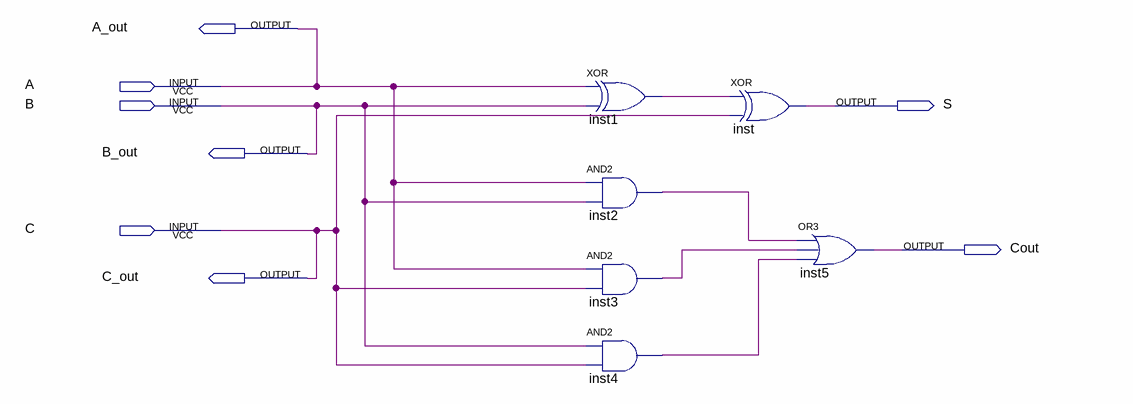
[diagram p0: schematic sheet]
// Quartus schematic Lab3Sec2_FullAdder.bdf as structural Verilog: 6 symbols, 8 pins
module Lab3Sec2_FullAdder (
  input  A,
  input  B,
  input  C,
  output A_out,
  output S,
  output B_out,
  output Cout,
  output C_out
);

  wire inst1_out, inst2_out, inst3_out, inst4_out;

  xor inst1 (inst1_out, A, B);
  and inst2 (inst2_out, A, B);
  and inst3 (inst3_out, A, C);
  and inst4 (inst4_out, B, C);
  xor inst (S, inst1_out, C);
  or inst5 (Cout, inst2_out, inst3_out, inst4_out);

  assign A_out = A;
  assign B_out = B;
  assign C_out = C;
endmodule
